# Altium schematic sheet AUDIO.SchDoc: Audio Codec WOLFSON and Audio Connectors
size A4; Author: N.P; CompanyName: STMicroelectronics; Organization: MCD/APPLIS/LMS; DocumentNumber: 5; SheetNumber: 5; SheetTotal: 13; Project: STM32F723e-DISCO
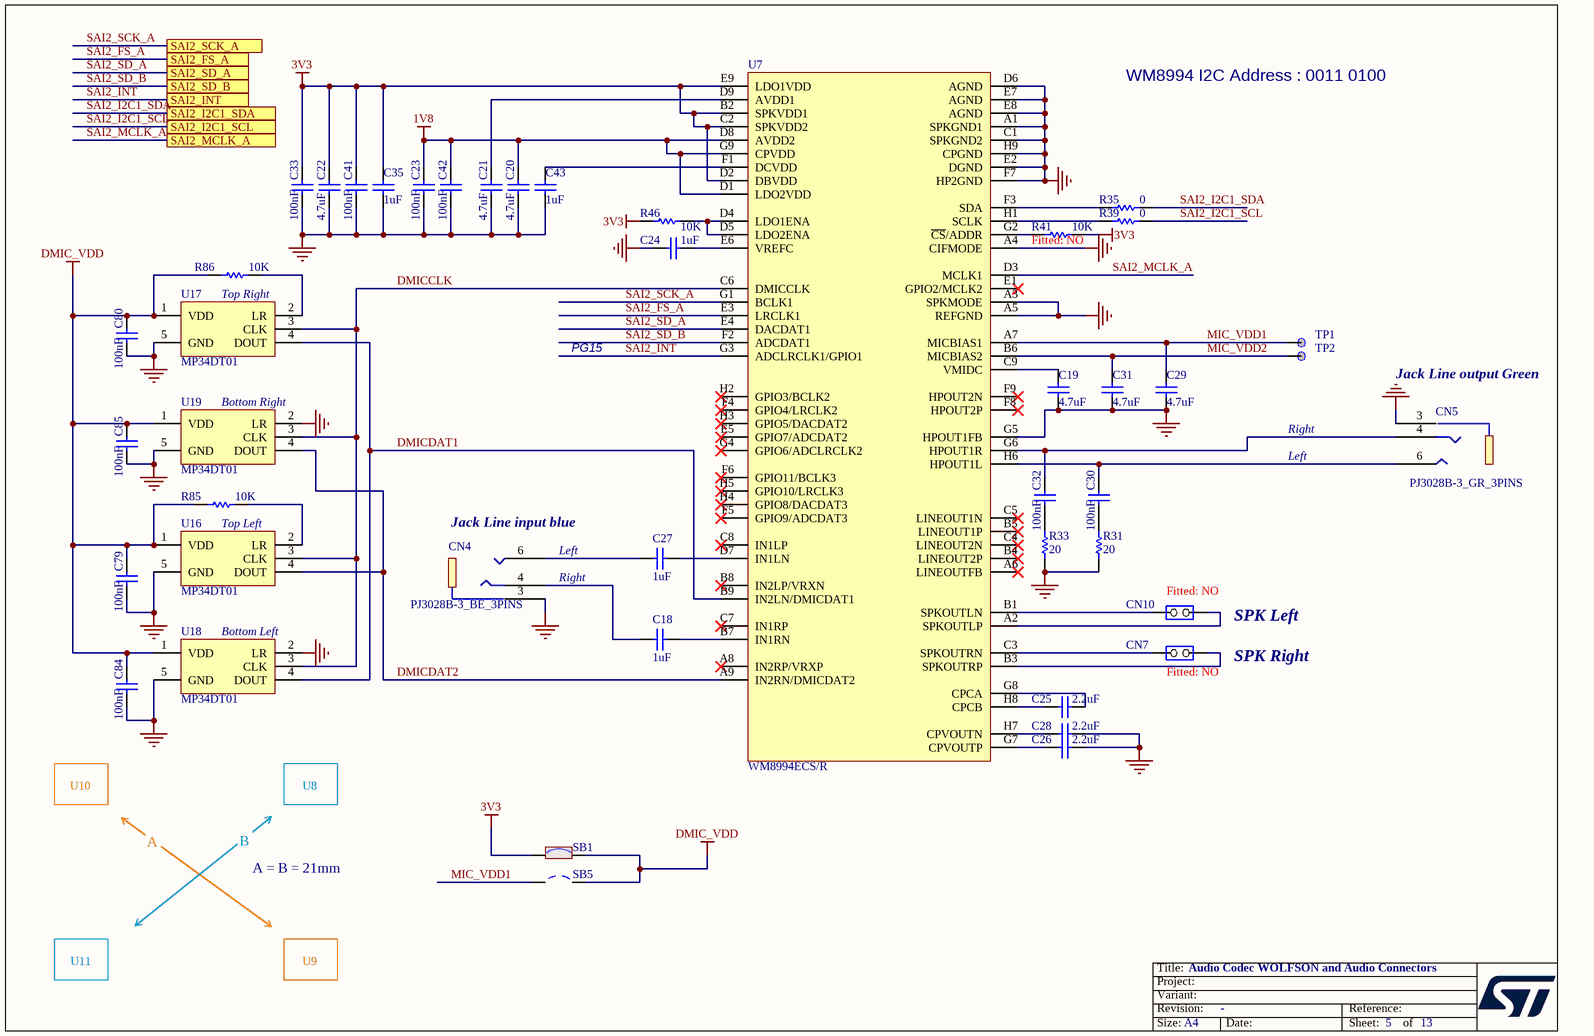
[diagram p0: AUDIO.SchDoc]

## Parts
C18  1uF  [0603C]
C19  4.7uF  [0603C]
C20  4.7uF  [0603C]
C21  4.7uF  [0603C]
C22  4.7uF  [0603C]
C23  100nF  [0402C]
C24  1uF  [0603C]
C25  value 2.2uF  [0603C]  (hidden comment: 2.2uF_X5R_10%_0603)
C26  value 2.2uF  [0603C]  (hidden comment: 2.2uF_X5R_10%_0603)
C27  1uF  [0603C]
C28  value 2.2uF  [0603C]  (hidden comment: 2.2uF_X5R_10%_0603)
C29  4.7uF  [0603C]
C30  100nF  [0402C]
C31  4.7uF  [0603C]
C32  100nF  [0402C]
C33  100nF  [0402C]
C35  1uF  [0603C]
C41  100nF  [0402C]
C42  100nF  [0402C]
C43  1uF  [0603C]
C79  100nF  [0402C]
C80  100nF  [0402C]
C84  100nF  [0402C]
C85  100nF  [0402C]
CN4  PJ3028B-3_BE_3PINS  [PJ3028B]
CN5  PJ3028B-3_GR_3PINS  [PJ3028B]
CN7  Fitted: NO  [SIP2]  (hidden comment: JP2)
CN10  Fitted: NO  [SIP2]  (hidden comment: JP2)
R31  20  [0402R]
R33  20  [0402R]
R35  0  [0402R]
R39  0  [0402R]
R41  Fitted: NO  [0402R]  (hidden comment: 10K)
R46  10K  [0402R]
R85  10K  [0402R]
R86  10K  [0402R]
SB1  Solder Bridge ON  [JP2_SMD]  (value not drawn)
SB5  Solder Bridge OFF  [JP2_SMD]  (value not drawn)
TP1  TP  [TP_C40]  (value not drawn)
TP2  TP  [TP_C40]  (value not drawn)
U7  WM8994ECS/R  [BGA72_0R5_4R5X4]
U16  MP34DT01  [MP34DT01TR]
U17  MP34DT01  [MP34DT01TR]
U18  MP34DT01  [MP34DT01TR]
U19  MP34DT01  [MP34DT01TR]

## Ports
SAI2_FS_A, SAI2_I2C1_SCL, SAI2_I2C1_SDA, SAI2_INT, SAI2_MCLK_A, SAI2_SCK_A, SAI2_SD_A, SAI2_SD_B

## Nets
1V8: C20.1 C23.1 C42.1 U7.D1(LDO2VDD) U7.D8(AVDD2) U7.G9(CPVDD)
3V3: C22.1 C33.1 C35.2 C41.1 R41.1 R46.2 SB1.1 U7.B2(SPKVDD1) U7.C2(SPKVDD2) U7.D2(DBVDD) U7.E9(LDO1VDD)
DMIC_VDD: C79.1 C80.1 C84.1 C85.1 R85.2 R86.2 SB1.2 SB5.2 U16.1(VDD) U17.1(VDD) U18.1(VDD) U19.1(VDD)
GND: C19.1 C20.2 C21.2 C22.2 C23.2 C24.2 C26.2 C28.2 C29.1 C31.1 C33.2 C35.1 C41.2 C42.2 C43.1 C79.2 C80.2 C84.2 C85.2 CN4.3 CN5.3 R31.2 R33.2 U7.A1(SPKGND1) U7.A3(SPKMODE) U7.A4(CIFMODE) U7.A5(REFGND) U7.C1(SPKGND2) U7.D6(AGND) U7.E2(DGND) U7.E7(AGND) U7.E8(AGND) U7.F7(HP2GND) U7.G5(HPOUT1FB) U7.H9(CPGND) U16.5(GND) U17.5(GND) U18.2(LR) U18.5(GND) U19.2(LR) U19.5(GND)
DMICCLK: U7.C6(DMICCLK) U16.3(CLK) U17.3(CLK) U18.3(CLK) U19.3(CLK)
DMICDAT1: U7.B9(IN2LN/DMICDAT1) U17.4(DOUT) U18.4(DOUT)
DMICDAT2: U7.A9(IN2RN/DMICDAT2) U16.4(DOUT) U19.4(DOUT)
MIC_VDD1: C29.2 SB5.1 TP1.1 U7.A7(MICBIAS1)
MIC_VDD2: C31.2 TP2.1 U7.B6(MICBIAS2)
SAI2_FS_A: U7.E3(LRCLK1) ; port SAI2_FS_A
SAI2_I2C1_SCL: R39.1 ; port SAI2_I2C1_SCL
SAI2_I2C1_SDA: R35.1 ; port SAI2_I2C1_SDA
SAI2_INT: U7.G3(ADCLRCLK1/GPIO1) ; port SAI2_INT
SAI2_MCLK_A: U7.D3(MCLK1) ; port SAI2_MCLK_A
SAI2_SCK_A: U7.G1(BCLK1) ; port SAI2_SCK_A
SAI2_SD_A: U7.E4(DACDAT1) ; port SAI2_SD_A
SAI2_SD_B: U7.F2(ADCDAT1) ; port SAI2_SD_B
NetC18_1: C18.1 U7.B7(IN1RN)
NetC18_2: C18.2 CN4.4
NetC19_2: C19.2 U7.C9(VMIDC)
NetC21_1: C21.1 U7.D9(AVDD1)
NetC24_1: C24.1 U7.E6(VREFC)
NetC25_1: C25.1 U7.H8(CPCB)
NetC25_2: C25.2 U7.G8(CPCA)
NetC26_1: C26.1 U7.G7(CPVOUTP)
NetC27_1: C27.1 U7.D7(IN1LN)
NetC27_2: C27.2 CN4.6
NetC28_1: C28.1 U7.H7(CPVOUTN)
NetC30_1: C30.1 CN5.6 U7.H6(HPOUT1L)
NetC30_2: C30.2 R31.1
NetC32_1: C32.1 CN5.4 U7.G6(HPOUT1R)
NetC32_2: C32.2 R33.1
NetC43_2: C43.2 U7.F1(DCVDD)
NetCN7_1: CN7.1(COMMON) U7.C3(SPKOUTRN)
NetCN7_2: CN7.2(NO) U7.B3(SPKOUTRP)
NetCN10_1: CN10.1(COMMON) U7.B1(SPKOUTLN)
NetCN10_2: CN10.2(NO) U7.A2(SPKOUTLP)
NetR35_2: R35.2 U7.F3(SDA)
NetR39_2: R39.2 U7.H1(SCLK)
NetR41_2: R41.2 U7.G2(~{CS}/ADDR)
NetR46_1: R46.1 U7.D4(LDO1ENA) U7.D5(LDO2ENA)
NetR85_1: R85.1 U16.2(LR)
NetR86_1: R86.1 U17.2(LR)

Not connected (* = marked no-connect by the designer): U7 A6(LINEOUTFB)* A8(IN2RP/VRXP)* B4(LINEOUT2P)* B5(LINEOUT1P)* B8(IN2LP/VRXN)* C4(LINEOUT2N)* C5(LINEOUT1N)* C7(IN1RP)* C8(IN1LP)* E1(GPIO2/MCLK2)* E5(GPIO7/ADCDAT2)* F4(GPIO4/LRCLK2)* F5(GPIO9/ADCDAT3)* F6(GPIO11/BCLK3)* F8(HPOUT2P)* F9(HPOUT2N)* G4(GPIO6/ADCLRCLK2)* H2(GPIO3/BCLK2)* H3(GPIO5/DACDAT2)* H4(GPIO8/DACDAT3)* H5(GPIO10/LRCLK3)*

## Notes on the sheet
- WM8994 I2C Address : 0011 0100
- Top Right
- PG15
- (near CN5) Jack Line output Green
- (near U19) Bottom Right
- Right
- Left
- Top Left
- (near CN4) Jack Line input blue
- (near U18) Bottom Left
- SPK Left
- SPK Right
- U10
- A
- B
- U8
- A = B = 21mm
- U11
- U9
- Title:
- Project:
- Size:
- Revision:
- Variant:
- A4
- -
- Date:
- Reference:
- Sheet:
- of

## Library data of the parts
C18 C24 C27 C35 C43 = Cap_1uF_X5R_10%_0603: Capacitor,1uF,16V,X5R,10%,0603,YAGEO; Manuf_Part_1: CC0603KRX5R7BB105; Ordered by: Subcon; Fitted: YES; Revision: July-2002: Re-released for DXP Platform.; Value: 1uF; Order: CC0603KRX5R7BB105; Manuf_1: YAGEO; ECCN_US/EU: n/a
C19-C22 C29 C31 = Cap_4.7uF_X5R_10%_0603: Capacitor,4.7uF,16V, X5R,10%,0603,YAGEO; Manuf_Part_1: CC0603KRX5R7BB475; Order: CC0603KRX5R7BB105; Ordered by: Subcon; Fitted: YES; Revision: July-2002: Re-released for DXP Platform.; Value: 4.7uF; Manuf_1: YAGEO; ECCN_US/EU: n/a
C23 C30 C32 C33 C41 C42 C79 C80 C84 C85 = Cap_100nF_X7R_10%_0402: Capacitor,100nF,16V,X7R,10%,0402,YAGEO; Manuf_Part_1: CC0402KRX7R7BB104; Ordered by: Subcon; Fitted: YES; Revision: July-2002: Re-released for DXP Platform.; Value: 100nF; Order: CC0402KRX7R7BB104; Manuf_1: YAGEO; ECCN_US/EU: n/a
C25 C26 C28 = Cap_2.2uF_X5R_10%_0603: Capacitor,2.2uF,10V, X5R,10%,0603,YAGEO; Manuf_Part_1: CC0603KRX5R6BB225; Manuf_Part_2: C0603C225K8PACTU; Manuf_2: KEMET; Ordered by: Subcon; Fitted: YES; Revision: July-2002: Re-released for DXP Platform.; Order: *; Manuf_1: YAGEO; ECCN_US/EU: n/a
CN4 = PJ3028B-3_BE_3PINS: Connector Jack Stereo 3.5mm, female SMT, Blue (Line input); Manuf_Part_2: PJ30280-3_BE; Ordered by: Subcon; Fitted: YES; ECCN_US/EU: n/a; Manuf_Part_1: PJ3028B-3_BE; Manuf_1: http://ww.qiaod.com
CN5 = PJ3028B-3_GR_3PINS: Connector Jack Stereo 3.5mm, female SMT, Green (Line output); Manuf_Part_2: PJ30280-3_GR; Ordered by: Subcon; Fitted: YES; ECCN_US/EU: n/a; Manuf_Part_1: PJ3028B-3_GR; Manuf_1: http://ww.qiaod.com
CN7 CN10 = JP2: Ordered by: Subcon; ECCN_US/EU: n/a
R31 R33 = Res_20_1%_0402: Resistor,20,0402,1%,YAGEO; Manuf_Part_1: RC0402FR-0720RL; Ordered by: Subcon; Fitted: YES; Value: 20; Manuf_1: YAGEO; Order: *; ECCN_US/EU: n/a
R35 R39 = Res_0_5%_0402: Resistor,0,0402,5%,YAGEO; Manuf_Part_1: RC0402JR-070RL; Order: 2363467; Ordered by: Subcon; Fitted: YES; Value: 0; ECCN_US/EU: n/a; Manuf_1: YAGEO; Distrib: FARNELL
R41 = Res_10K_1%_0402: Resistor,10K,0402,1%,YAGEO; Manuf_Part_1: RC0402FR-0710KL; Ordered by: Subcon; Value: 10K; Manuf_1: YAGEO; Order: RC0402FR-0710KL; ECCN_US/EU: n/a
R46 R85 R86 = Res_10K_1%_0402: Resistor,10K,0402,1%,YAGEO; Manuf_Part_1: RC0402FR-0710KL; Ordered by: Subcon; Fitted: YES; Value: 10K; Manuf_1: YAGEO; Order: RC0402FR-0710KL; ECCN_US/EU: n/a
SB1 = SB_ON: Fitted: YES; Ordered by: Subcon; Revision: July-2002: Re-released for DXP Platform.; ECCN_US/EU: n/a
SB5 = SB_OFF: Fitted: NO; Ordered by: Subcon; Revision: July-2002: Re-released for DXP Platform.; ECCN_US/EU: n/a
TP1 TP2 = TP: Test Point; Fitted: NO; Ordered by: Subcon; ECCN_US/EU: n/a
U7 = WM8994ECS/R: Multi-Channel Audio Hub CODEC for Smartphones; Manuf_1: Cirrus Logic; Ordered by: Subcon; Fitted: YES; Manuf_Part_1: WM8994ECS/R; Distrib: Cirrus Logic; ECCN_US/EU: n/a
U16-U19 = MP34DT01: MEMS audio sensor, omnidirectional digital microphone; Manuf_1: STM; Manuf_Part_1: MP34DT01TR-M; Provided: ST; Ref St: 9188008; ECCN_US/EU: EAR99/NEC; Fitted: YES; Order: MP34DT01TR-M; Distrib: ST; Ordered by: ST